# EAGLE design dma-module (EAGLE 8.4.3)
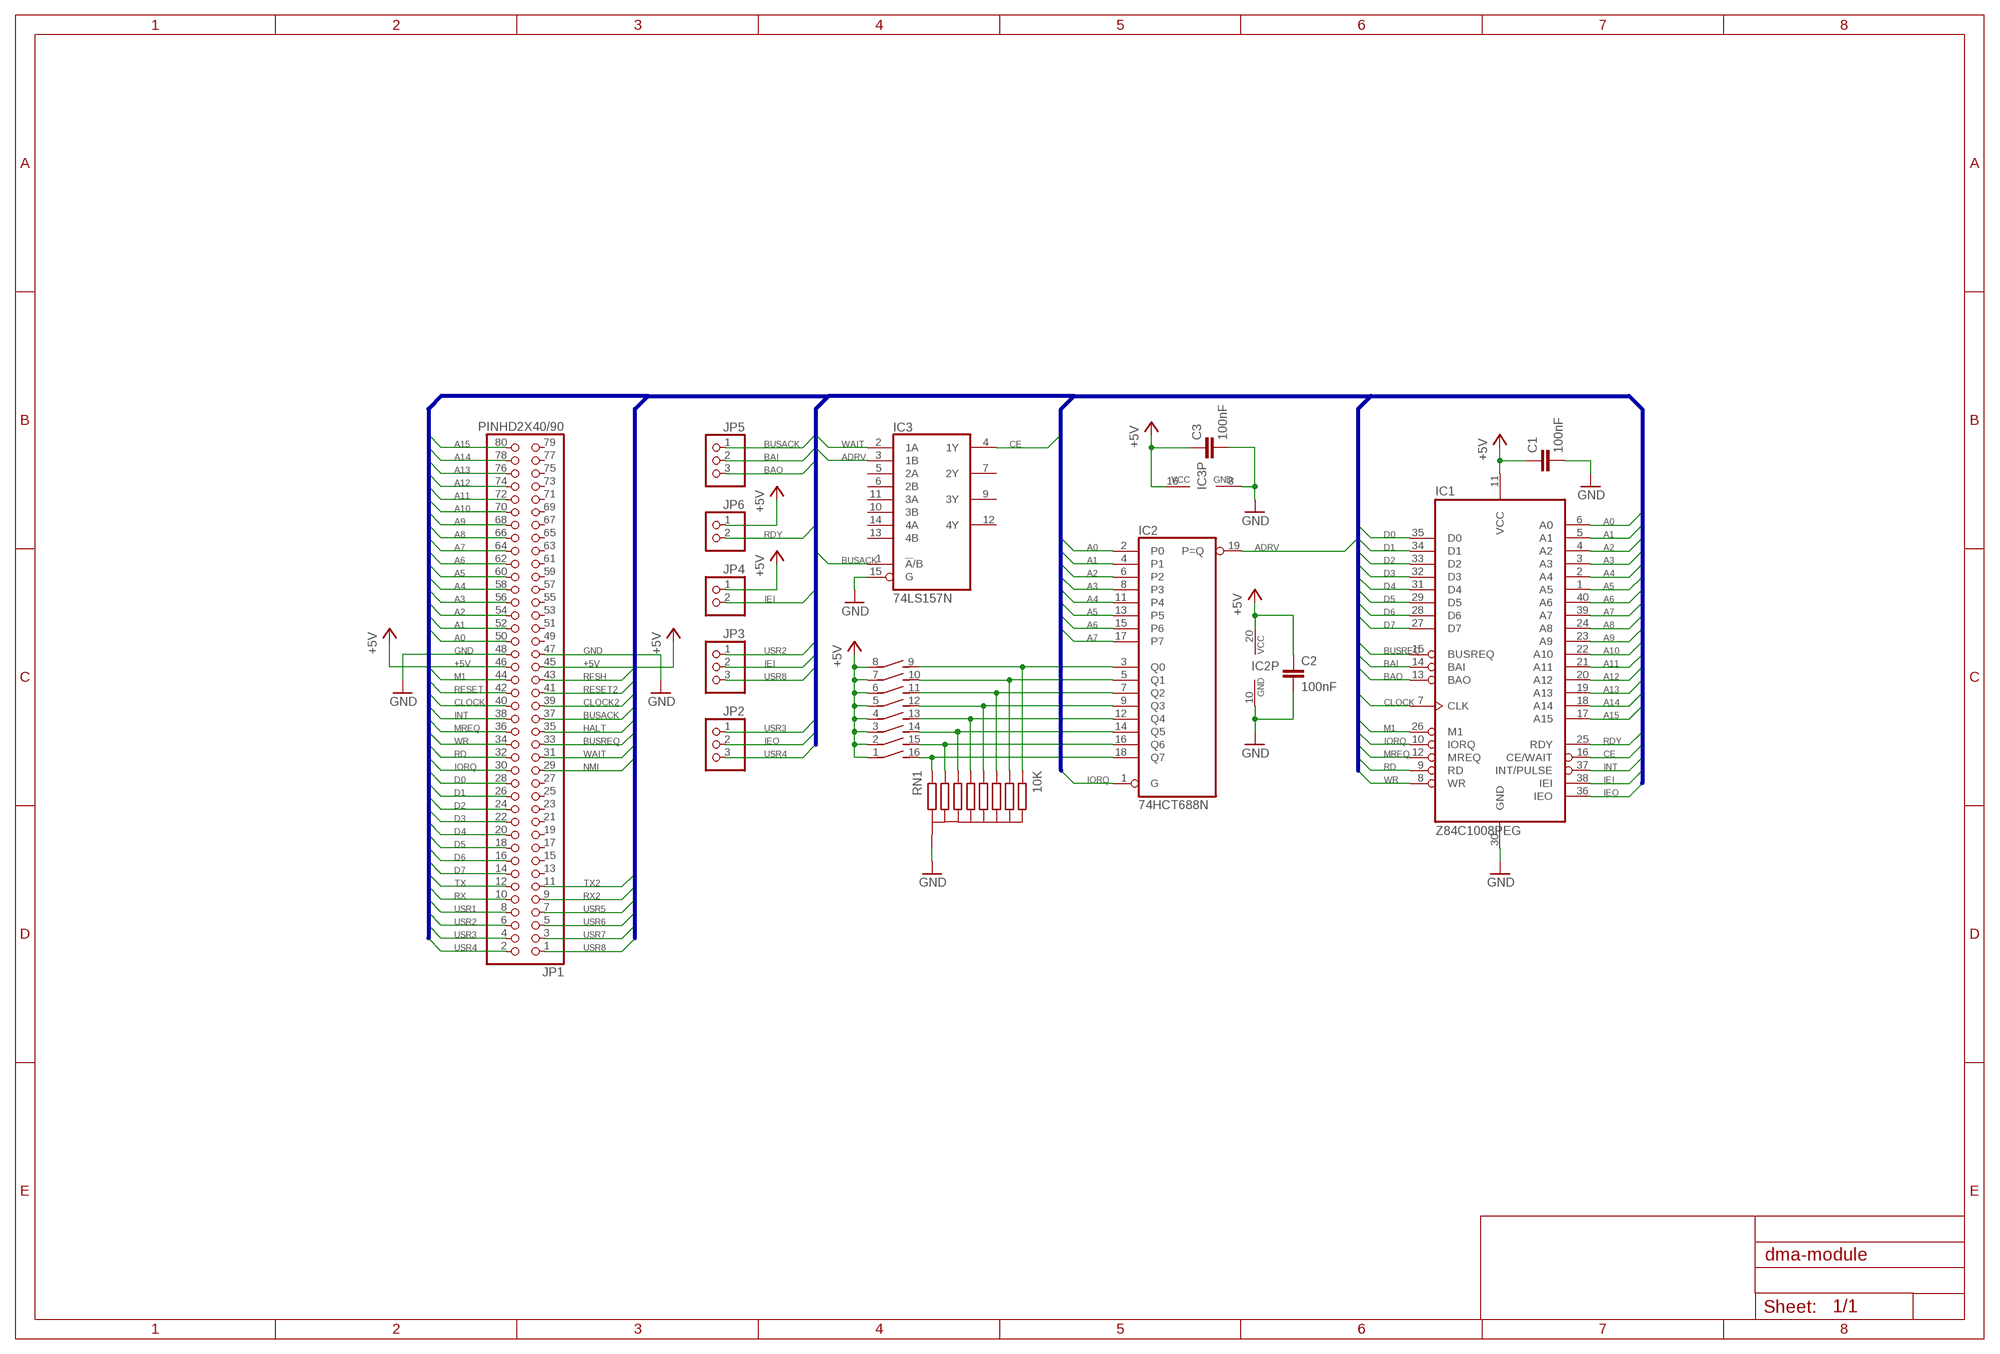
[diagram p0: schematic, sheet 1]
FRAME1 (A3L-LOC): LOGO: DMA; TITLE: Z84C10 DMA board

## Parts
C1  100nF  C-EU025-025X050  [C025-025X050]
C2  100nF  C-EU025-025X050  [C025-025X050]
C3  100nF  C-EU025-025X050  [C025-025X050]
IC1  Z84C1008PEG  [DIP40]
IC2  74HCT688N  [DIL20]
IC3  74LS157N  [DIL16]
JP1  PINHD2X40/90  [2X40/90]
JP2  PINHD-1X3/90  [1X03/90]
JP3  PINHD-1X3/90  [1X03/90]
JP4  PINHD-1X2/90  [1X02/90]
JP5  PINHD-1X3/90  [1X03/90]
JP6  PINHD-1X2/90  [1X02/90]
RN1  10K  RBUS  [RBUS]
S1  DIP08SB  [DIP08SB]

## Nets
+5V: C1.1 C2.1 C3.1 IC1.11(VCC) IC2.20(VCC) IC3.16(VCC) JP1.45 JP1.46 JP4.1 JP6.1 S1.1 S1.2 S1.3 S1.4 S1.5 S1.6 S1.7 S1.8
A0: IC1.6(A0) IC2.2(P0) JP1.50
A1: IC1.5(A1) IC2.4(P1) JP1.52
A2: IC1.4(A2) IC2.6(P2) JP1.54
A3: IC1.3(A3) IC2.8(P3) JP1.56
A4: IC1.2(A4) IC2.11(P4) JP1.58
A5: IC1.1(A5) IC2.13(P5) JP1.60
A6: IC1.40(A6) IC2.15(P6) JP1.62
A7: IC1.39(A7) IC2.17(P7) JP1.64
A8: IC1.24(A8) JP1.66
A9: IC1.23(A9) JP1.68
A10: IC1.22(A10) JP1.70
A11: IC1.21(A11) JP1.72
A12: IC1.20(A12) JP1.74
A13: IC1.19(A13) JP1.76
A14: IC1.18(A14) JP1.78
A15: IC1.17(A15) JP1.80
ADRV: IC2.19(P=Q) IC3.3(1B)
BAI: IC1.14(BAI) JP5.2
BAO: IC1.13(BAO) JP5.3
BUSACK: IC3.1(!A!/B) JP1.37 JP5.1
BUSREQ: IC1.15(BUSREQ) JP1.33
CE: IC1.16(CE/WAIT) IC3.4(1Y)
CLOCK: IC1.7(CLK) JP1.40
CLOCK2: JP1.39
D0: IC1.35(D0) JP1.28
D1: IC1.34(D1) JP1.26
D2: IC1.33(D2) JP1.24
D3: IC1.32(D3) JP1.22
D4: IC1.31(D4) JP1.20
D5: IC1.29(D5) JP1.18
D6: IC1.28(D6) JP1.16
D7: IC1.27(D7) JP1.14
GND: C1.2 C2.2 C3.2 IC1.30(GND) IC2.10(GND) IC3.8(GND) IC3.15(G) JP1.47 JP1.48 RN1.P$1(COM)
HALT: JP1.35
IEI: IC1.38(IEI) JP3.2 JP4.2
IEO: IC1.36(IEO) JP2.2
INT: IC1.37(INT/PULSE) JP1.38
IORQ: IC1.10(IORQ) IC2.1(G) JP1.30
M1: IC1.26(M1) JP1.44
MREQ: IC1.12(MREQ) JP1.36
N$9: IC2.3(Q0) RN1.P$9(R8) S1.9
N$10: IC2.5(Q1) RN1.P$8(R7) S1.10
N$11: IC2.7(Q2) RN1.P$7(R6) S1.11
N$12: IC2.9(Q3) RN1.P$6(R5) S1.12
N$13: IC2.12(Q4) RN1.P$5(R4) S1.13
N$14: IC2.14(Q5) RN1.P$4(R3) S1.14
N$15: IC2.16(Q6) RN1.P$3(R2) S1.15
N$16: IC2.18(Q7) RN1.P$2(R1) S1.16
NMI: JP1.29
RD: IC1.9(RD) JP1.32
RDY: IC1.25(RDY) JP6.2
RESET: JP1.42
RESET2: JP1.41
RFSH: JP1.43
RX: JP1.10
RX2: JP1.9
TX: JP1.12
TX2: JP1.11
USR1: JP1.8
USR2: JP1.6 JP3.1
USR3: JP1.4 JP2.1
USR4: JP1.2 JP2.3
USR5: JP1.7
USR6: JP1.5
USR7: JP1.3
USR8: JP1.1 JP3.3
WAIT: IC3.2(1A) JP1.31
WR: IC1.8(WR) JP1.34
Unconnected: IC3.5(2A) IC3.6(2B) IC3.7(2Y) IC3.9(3Y) IC3.10(3B) IC3.11(3A) IC3.12(4Y) IC3.13(4B) IC3.14(4A) JP1.13 JP1.15 JP1.17 JP1.19 JP1.21 JP1.23 JP1.25 JP1.27 JP1.49 JP1.51 JP1.53 JP1.55 JP1.57 JP1.59 JP1.61 JP1.63 JP1.65 JP1.67 JP1.69 JP1.71 JP1.73 JP1.75 JP1.77 JP1.79

## Buses
A0,A1,A2,A3,A4,A5,A6,A7,A8,A9,A10,A11,A12,A13,A14,A15,M1,RESET,CLOCK,INT,MREQ,WR,RD,IORQ,D0,D1,D2,D3,D4,D5,D6,D7,TX,RX,USR1,USR2,USR3,USR4,RFSH,RESET2,CLOCK2,BUSACK,HALT,BUSREQ,WAIT,NMI,TX2,RX2,USR5,USR6,USR7,USR8,IEI,IEO,BAI,BAO,CE,ADRV,RDY

## Library data of the parts
C1-C3 = rcl:C-EU: CAPACITOR, European symbol
IC1 = z80dma:Z84C1008PEG
IC2 = 74xx-eu:74*688: 8-bit MAGNITUDE/IDENTITY COMPARATOR, totem pole
IC3 = 74xx-eu:74*157: Quadruple 2-line to 1-line data SELECTOR/MULTIPLEXER
JP1 = pinhead:PINHD2X40/90
JP2 JP3 JP5 = pinhead:PINHD-1X3: PIN HEADER
JP4 JP6 = pinhead:PINHD-1X2: PIN HEADER
RN1 = rbus:RBUS
S1 = switch-dil:DIP08SB: DIL/CODE SWITCH; OC_FARNELL: unknown; OC_NEWARK: unknown

## Board
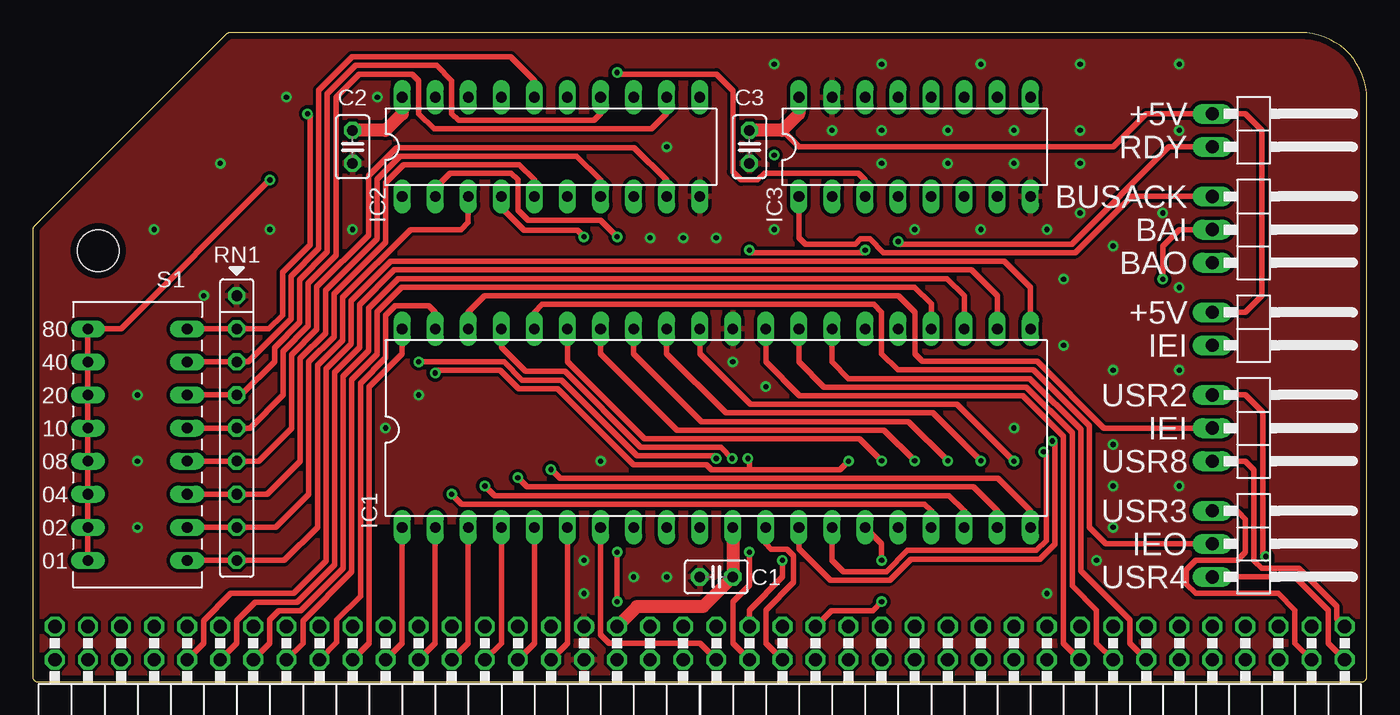
[diagram p1: board, top side]
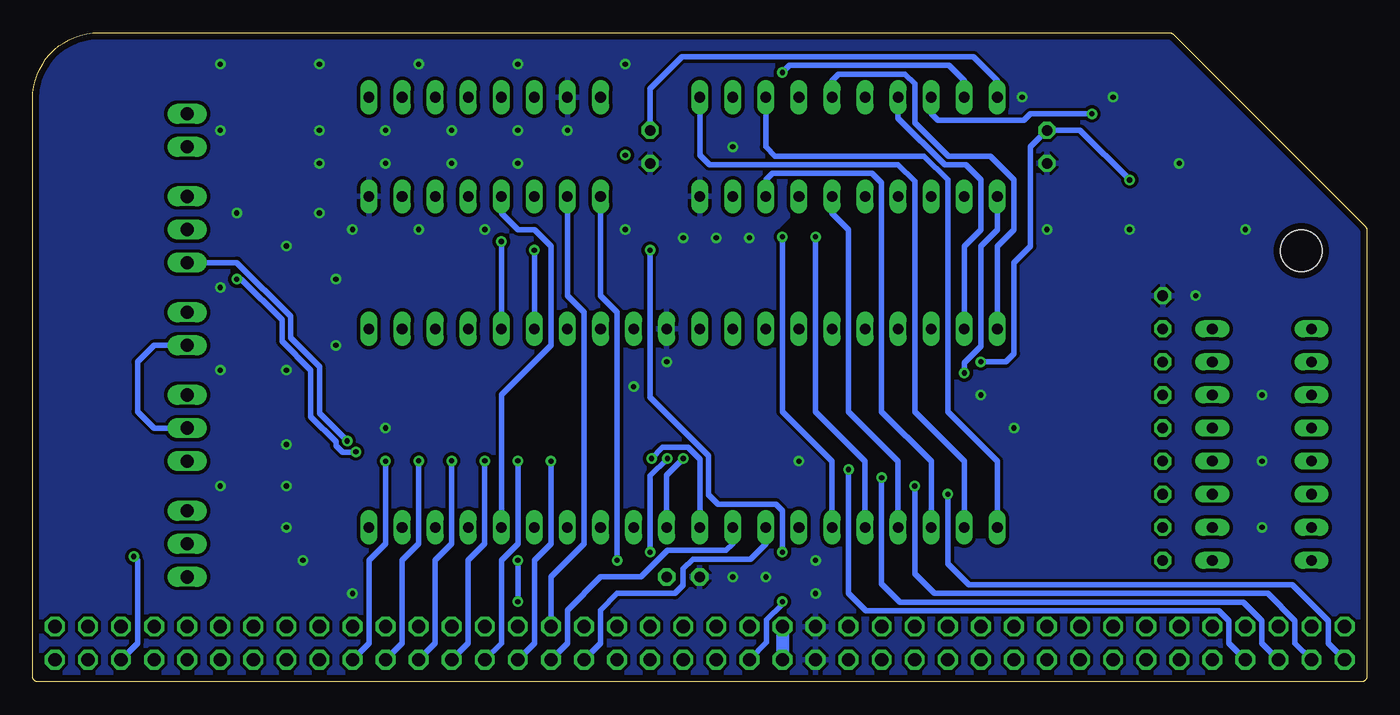
[diagram p2: board, bottom side, seen from below]

Size 102.49 x 49.86 mm. Coordinates in mm from the lower left corner, seen from the top.
Outline: 0,34.66 0,0.45 arc90 0.45,0 102.05,0 arc90 102.49,0.45 102.49,44.76 arc90 97.39,49.86 15.2,49.86 arc45 14.88,49.73 0.13,34.98 arc45 0,34.66
Copper layers (1*16): Top 0.035mm / dielectric 1.5mm / Bottom 0.035mm
Design rules "default *": minimum track width 16mil, minimum drill 0.4mm, track to track 10mil, track to pad 10mil, pad to pad 10mil, via to via 10mil, smd to smd 10mil, copper to edge 20mil, drill to drill 6mil, minimum pad ring 10mil, minimum via ring 8mil, stop-mask expansion 4mil, vias tented up to drill 0.41mm, thermal gap 10mil
Holes 3.2 mm at 5.03,33.12

### Footprints (pad centres in the part's own frame; a part is rotated, then mirrored left to right if it is on the bottom)
C025-025X050 = drill 0.813 octagon: 1 -1.27,0; 2 1.27,0
DIP40 = drill 0.813 long: 1 -24.13,-7.62; 2 -21.59,-7.62; 3 -19.05,-7.62; 4 -16.51,-7.62; 5 -13.97,-7.62; 6 -11.43,-7.62; 7 -8.89,-7.62; 8 -6.35,-7.62; 9 -3.81,-7.62; 10 -1.27,-7.62; 11 1.27,-7.62; 12 3.81,-7.62; 13 6.35,-7.62; 14 8.89,-7.62; 15 11.43,-7.62; 16 13.97,-7.62; 17 16.51,-7.62; 18 19.05,-7.62; 19 21.59,-7.62; 20 24.13,-7.62; 21 24.13,7.62; 22 21.59,7.62; 23 19.05,7.62; 24 16.51,7.62; 25 13.97,7.62; 26 11.43,7.62; 27 8.89,7.62; 28 6.35,7.62; 29 3.81,7.62; 30 1.27,7.62; 31 -1.27,7.62; 32 -3.81,7.62; 33 -6.35,7.62; 34 -8.89,7.62; 35 -11.43,7.62; 36 -13.97,7.62; 37 -16.51,7.62; 38 -19.05,7.62; 39 -21.59,7.62; 40 -24.13,7.62
DIL20 = drill 0.813 long: 1 -11.43,-3.81; 2 -8.89,-3.81; 3 -6.35,-3.81; 4 -3.81,-3.81; 5 -1.27,-3.81; 6 1.27,-3.81; 7 3.81,-3.81; 8 6.35,-3.81; 9 8.89,-3.81; 10 11.43,-3.81; 11 11.43,3.81; 12 8.89,3.81; 13 6.35,3.81; 14 3.81,3.81; 15 1.27,3.81; 16 -1.27,3.81; 17 -3.81,3.81; 18 -6.35,3.81; 19 -8.89,3.81; 20 -11.43,3.81
DIL16 = drill 0.813 long: 1 -8.89,-3.81; 2 -6.35,-3.81; 3 -3.81,-3.81; 4 -1.27,-3.81; 5 1.27,-3.81; 6 3.81,-3.81; 7 6.35,-3.81; 8 8.89,-3.81; 9 8.89,3.81; 10 6.35,3.81; 11 3.81,3.81; 12 1.27,3.81; 13 -1.27,3.81; 14 -3.81,3.81; 15 -6.35,3.81; 16 -8.89,3.81
2X40/90 = drill 1.016 octagon: 1 -49.53,-1.27; 2 -49.53,1.27; 3 -46.99,-1.27; 4 -46.99,1.27; 5 -44.45,-1.27; 6 -44.45,1.27; 7 -41.91,-1.27; 8 -41.91,1.27; 9 -39.37,-1.27; 10 -39.37,1.27; 11 -36.83,-1.27; 12 -36.83,1.27; 13 -34.29,-1.27; 14 -34.29,1.27; 15 -31.75,-1.27; 16 -31.75,1.27; 17 -29.21,-1.27; 18 -29.21,1.27; 19 -26.67,-1.27; 20 -26.67,1.27; 21 -24.13,-1.27; 22 -24.13,1.27; 23 -21.59,-1.27; 24 -21.59,1.27; 25 -19.05,-1.27; 26 -19.05,1.27; 27 -16.51,-1.27; 28 -16.51,1.27; 29 -13.97,-1.27; 30 -13.97,1.27; 31 -11.43,-1.27; 32 -11.43,1.27; 33 -8.89,-1.27; 34 -8.89,1.27; 35 -6.35,-1.27; 36 -6.35,1.27; 37 -3.81,-1.27; 38 -3.81,1.27; 39 -1.27,-1.27; 40 -1.27,1.27; 41 1.27,-1.27; 42 1.27,1.27; 43 3.81,-1.27; 44 3.81,1.27; 45 6.35,-1.27; 46 6.35,1.27; 47 8.89,-1.27; 48 8.89,1.27; 49 11.43,-1.27; 50 11.43,1.27; 51 13.97,-1.27; 52 13.97,1.27; 53 16.51,-1.27; 54 16.51,1.27; 55 19.05,-1.27; 56 19.05,1.27; 57 21.59,-1.27; 58 21.59,1.27; 59 24.13,-1.27; 60 24.13,1.27; 61 26.67,-1.27; 62 26.67,1.27; 63 29.21,-1.27; 64 29.21,1.27; 65 31.75,-1.27; 66 31.75,1.27; 67 34.29,-1.27; 68 34.29,1.27; 69 36.83,-1.27; 70 36.83,1.27; 71 39.37,-1.27; 72 39.37,1.27; 73 41.91,-1.27; 74 41.91,1.27; 75 44.45,-1.27; 76 44.45,1.27; 77 46.99,-1.27; 78 46.99,1.27; 79 49.53,-1.27; 80 49.53,1.27
1X03/90 = drill 1.016 long: 1 -2.54,-3.81; 2 0,-3.81; 3 2.54,-3.81
1X02/90 = drill 1.016 long: 1 -1.27,-3.81; 2 1.27,-3.81
RBUS = drill 0.813 octagon: P$1 0,0; P$2 2.54,0; P$3 5.08,0; P$4 7.62,0; P$5 10.16,0; P$6 12.7,0; P$7 15.24,0; P$8 17.78,0; P$9 20.32,0
DIP08SB = drill 0.813 long: 1 -8.89,-3.81; 2 -6.35,-3.81; 3 -3.81,-3.81; 4 -1.27,-3.81; 5 1.27,-3.81; 6 3.81,-3.81; 7 6.35,-3.81; 8 8.89,-3.81; 9 8.89,3.81; 10 6.35,3.81; 11 3.81,3.81; 12 1.27,3.81; 13 -1.27,3.81; 14 -3.81,3.81; 15 -6.35,3.81; 16 -8.89,3.81

### Placement (x,y rotation side)
C1  52.52,8.06 180 top
C2  24.57,41.09 270 top
C3  55.05,41.09 270 top
IC1  52.52,19.5 0 top
IC2  39.81,41.09 0 top
IC3  67.75,41.09 0 top
JP1  51.24,2.98 180 top
JP2  94.42,10.61 270 top
JP3  94.42,19.5 270 top
JP4  94.42,27.11 270 top
JP5  94.42,34.73 270 top
JP6  94.42,42.35 270 top
RN1  15.69,29.66 270 top
S1  8.06,18.23 270 top

### Tracks (layer width: path | path; a pad name or v marks a point on that pad's centre or on a via)
+5V  (via drill 0.4)
  Top 0.406: v29.66,24.57 36.2,24.57 37.59,23.18 40.61,23.18 46.44,17.36 52.31,17.36 v52.52,17.16 | 57.59,42.35 58.87,41.09 83,41.09 85.53,43.62 JP6.1 93.16,43.62 94.42,42.35 94.42,29.66 93.16,28.39 JP4.1 | S1.8 S1.7 S1.6 S1.5 S1.4 S1.3 S1.2 S1.1 6.79,27.11 v18.23,38.55
  Top 1.016: IC2.20 28.39,43.62 27.11,42.35 C2.1 | IC3.16 58.87,43.62 57.59,42.35 C3.1 | IC1.11 C1.1 51.5,5.78 46.42,5.78 JP1.45
  Bottom 0.406: v29.66,24.57 27.75,24.57 27.11,25.21 27.11,32.2 25.84,33.47 25.84,41.09 C2.1 22.04,42.35 v18.23,38.55 | IC2.20 28.39,46.16 30.21,47.99 52.59,47.99 55.05,45.53 C3.1 | v52.52,17.16 53.78,15.88 IC1.11
  Bottom 1.016: JP1.45 JP1.46
A0  (via drill 0.4)
  Top 0.406: IC1.6 41.09,2.98 JP1.50 | IC2.2 30.93,37.91 32.07,39.05 36.77,39.05 37.27,38.55 37.27,36.23 38.06,35.45 43.62,35.45 v44.9,34.17
  Bottom 0.406: IC1.6 41.09,16.95 44.9,20.77 v44.9,34.17
A1  (via drill 0.4)
  Top 0.406: IC1.5 38.55,2.98 JP1.52 | v42.35,34.17 41.84,34.68 37.74,34.68 36.01,36.42 IC2.4
  Bottom 0.406: IC1.5 38.55,16.95 42.35,20.77 v42.35,34.17
A2
  Top 0.406: IC1.4 36.01,2.98 JP1.54
  Bottom 0.406: IC1.4 36.01,16.95 39.81,20.77 39.81,34.73 41.09,36.01 IC2.6
A3
  Top 0.406: IC1.3 33.47,2.98 JP1.56
  Bottom 0.406: IC1.3 33.47,16.95 37.27,20.77 37.27,38.32 38.01,39.05 45.66,39.05 46.16,38.55 IC2.8
A4
  Top 0.406: IC1.2 30.93,2.98 JP1.58
  Bottom 0.406: IC1.2 30.93,16.95 34.73,20.77 34.73,38.44 36.01,39.71 50.51,39.71 51.24,40.45 IC2.11
A5
  Top 0.406: IC1.1 28.39,2.98 JP1.60
  Bottom 0.406: IC1.1 28.39,16.95 32.2,20.77 32.2,38.55 34.02,40.37 45.45,40.37 46.16,41.09 IC2.13
A6
  Top 0.406: JP1.62 25.84,2.98 25.84,22.67 28.39,25.21 IC1.40
  Bottom 0.406: IC1.40 28.39,33.47 27.11,34.73 27.11,38.55 28.93,40.36 32.14,40.36 34.73,42.95 34.73,45.94 35.47,46.67 40.58,46.67 41.09,46.16 IC2.15
A7
  Top 0.406: JP1.64 23.36,3.04 23.36,4.76 25.18,6.59 25.18,22.94 27.11,24.87 27.11,28.16 27.85,28.89 30.42,28.89 30.93,28.39 IC1.39
  Bottom 0.406: IC1.39 30.93,33.47 29.66,34.73 29.66,38.55 30.81,39.7 32.42,39.7 36.01,43.29 IC2.17
A8
  Top 0.406: JP1.66 20.77,2.98 20.77,4.71 24.52,8.47 24.52,23.22 26.45,25.15 26.45,28.43 28.34,30.31 67.73,30.31 69.03,29.02 IC1.24
A9
  Top 0.406: JP1.68 18.23,2.98 18.23,4.78 18.92,5.47 20.6,5.47 23.86,8.74 23.86,23.49 25.79,25.42 25.79,28.7 28.06,30.97 70.25,30.97 71.56,29.66 IC1.23
A10
  Top 0.406: JP1.70 15.69,2.98 15.69,4.71 17.11,6.13 20.32,6.13 23.2,9.02 23.2,23.76 25.13,25.7 25.13,28.98 27.79,31.63 72.13,31.63 74.11,29.66 IC1.22
A11
  Top 0.406: IC1.21 76.64,30.29 74.64,32.29 27.52,32.29 24.47,29.25 24.47,25.97 22.54,24.04 22.54,9.29 20.05,6.79 15.23,6.79 13.14,4.71 13.14,2.98 JP1.72
A12  (via drill 0.4)
  Top 0.406: IC1.20 76.64,13.14 74.16,15.63 40.5,15.63 v39.81,16.32
  Bottom 0.406: JP1.74 10.61,2.98 10.61,4.71 11.37,5.47 38.49,5.47 39.81,6.79 v39.81,16.32
A13  (via drill 0.4)
  Top 0.406: IC1.19 74.11,13.14 72.28,14.97 37.99,14.97 v37.27,15.69
  Bottom 0.406: JP1.76 8.06,2.98 8.06,4.71 9.49,6.13 35.85,6.13 37.27,7.56 v37.27,15.69
A14  (via drill 0.4)
  Top 0.406: IC1.18 71.56,13.14 70.4,14.31 35.47,14.31 v34.73,15.05
  Bottom 0.406: JP1.78 5.53,2.98 5.53,4.71 7.61,6.79 33.21,6.79 34.73,8.32 v34.73,15.05
A15  (via drill 0.4)
  Top 0.406: IC1.17 69.03,13.14 68.52,13.65 32.96,13.65 v32.2,14.41
  Bottom 0.406: v32.2,14.41 32.2,9.08 30.57,7.46 5.73,7.46 2.98,4.71 2.98,2.98 JP1.80
ADRV  (via drill 0.4)
  Top 0.406: v44.9,46.8 45.02,46.67 52.52,46.67 53.78,45.4 53.78,39.18 54.42,38.55 55.69,38.55 56.2,39.05 63.44,39.05 63.95,38.55 IC3.3
  Bottom 0.406: IC2.19 30.93,46.16 32.09,47.33 44.36,47.33 v44.9,46.8
BAI  (via drill 0.4)
  Top 0.406: IC1.14 61.41,9.34 62.27,8.47 65.57,8.47 67.19,10.1 77.11,10.1 77.86,10.85 77.86,17.46 v77.66,17.66 | v86.81,30.93 86.81,33.47 88.08,34.73 JP5.2
  Bottom 0.406: v77.66,17.66 77.69,17.64 78.68,17.64 79.19,18.15 79.19,18.43 81.11,20.36 81.11,23.94 83.34,26.16 83.34,27.79 86.47,30.93 v86.81,30.93
BAO  (via drill 0.4)
  Top 0.406: IC1.13 58.87,10.22 61.27,7.81 65.84,7.81 67.47,9.44 77.38,9.44 78.53,10.58 78.53,18.3 v78.33,18.5
  Bottom 0.406: v78.33,18.5 80.45,20.63 80.45,24.21 82.68,26.44 82.68,28.07 86.81,32.2 JP5.3
BUSACK  (via drill 0.4)
  Top 0.406: JP1.37 55.05,5.53 57.59,8.06 v57.59,9.34 | IC3.1 58.87,34.1 59.35,33.62 63.19,33.62 63.59,34.02 64.3,34.02 65.36,32.95 80.09,32.95 84.41,37.27 JP5.1
  Bottom 0.406: IC3.1 58.87,29.66 57.59,28.39 v57.59,9.34
BUSREQ  (via drill 0.4)
  Top 0.406: IC1.15 65.22,10.61 v65.22,9.34 | v65.22,6.16 64.53,5.47 61.35,5.47 JP1.33
  Bottom 0.406: v65.22,9.34 v65.22,6.16
CE
  Bottom 0.406: IC1.16 66.48,22.04 62.67,25.84 62.67,33.47 63.95,34.73 65.22,34.73 66.48,36.01 IC3.4
CLOCK
  Top 0.406: JP1.40 51.24,2.98 44.26,2.98 43.62,3.62 IC1.7
D0  (via drill 0.4)
  Top 0.406: IC1.35 41.09,24.57 46.98,18.68 63.52,18.68 v65.22,16.98
  Bottom 0.406: JP1.28 66.48,2.98 66.48,9.34 65.22,10.61 v65.22,16.98
D1  (via drill 0.4)
  Top 0.406: IC1.34 43.62,25.21 49.5,19.34 65.4,19.34 v67.75,16.98
  Bottom 0.406: JP1.26 69.03,2.98 69.03,9.34 67.75,10.61 v67.75,16.98
D2  (via drill 0.4)
  Top 0.406: IC1.33 46.16,25.21 51.38,20 67.28,20 v70.3,16.98
  Bottom 0.406: JP1.24 71.56,2.98 71.56,9.34 70.3,10.61 v70.3,16.98
D3  (via drill 0.4)
  Top 0.406: IC1.32 48.7,25.21 53.26,20.66 69.16,20.66 v72.83,16.98
  Bottom 0.406: JP1.22 74.11,2.98 74.11,9.34 72.83,10.61 v72.83,16.98
D4  (via drill 0.4)
  Top 0.406: IC1.31 51.24,25.21 55.14,21.32 71.01,21.32 v75.38,16.95
  Bottom 0.406: JP1.20 76.64,2.98 76.64,9.34 75.38,10.61 v75.38,16.95
D5
  Top 0.406: IC1.29 56.33,24.57 58.92,21.98 76.07,21.98 79.19,18.86 79.19,2.98 JP1.18
D6
  Top 0.406: IC1.28 58.87,24.57 60.8,22.64 76.34,22.64 79.84,19.13 79.84,7.41 81.72,5.53 81.72,2.98 JP1.16
D7
  Top 0.406: IC1.27 61.41,24.57 62.68,23.3 76.61,23.3 80.51,19.41 80.51,8.54 84.27,4.78 84.27,2.98 JP1.14
GND  (via drill 0.4)
  other vias: 77.92,6.79 81.72,9.34 83,11.88 83,15.05 83,18.23 83,23.94 75.38,19.5 29.66,22.04 27.11,19.5 43.62,16.95 42.35,9.34 42.35,6.79 46.16,8.06 48.7,8.06 26.48,44.9 24.57,34.73 18.23,34.73 19.5,44.9 56.96,34.73 52.52,34.1 49.98,34.1 47.44,34.1 61.41,42.35 67.75,34.73 72.83,34.73 77.92,34.73 79.19,30.93 79.19,25.84 83,33.47 80.45,36.01 80.45,39.81 80.45,42.35 75.38,42.35 75.38,39.81 70.3,39.81 70.3,42.35 65.22,42.35 65.22,39.81 65.22,47.44 72.83,47.44 80.45,47.44 56.96,47.44 53.78,24.57 56.33,22.67 9.34,34.73 13.14,29.66 14.41,39.81 8.06,22.04 8.06,16.95 8.06,11.88 88.08,15.05 88.08,23.94 88.08,30.29 86.81,36.01 88.08,42.35 88.08,47.44 48.7,41.09
  pour Bottom: 0,0 0,50.8 104.14,50.8 104.14,0
  pour Top: 0,0 0,50.8 104.14,50.8 104.14,0
  cutout Bottom: 28.39,11.88 33.47,11.88 33.47,11.24 28.39,11.24
  cutout Top: 26.48,11.88 33.47,11.88 33.47,11.24 26.48,11.24
  cutout Bottom: 43.62,36.01 44.9,34.73 44.9,34.1 44.26,34.1 42.99,35.37 42.99,36.01
IEI
  Top 0.406: IC1.38 33.47,28.39 34.73,29.65 66.49,29.65 67.75,28.39 67.75,25.21 68.35,24.62 77.16,24.62 82.29,19.5 JP3.2
  Bottom 0.406: JP3.2 93.16,19.5 94.42,20.77 94.42,24.57 93.16,25.84 JP4.2
IEO
  Top 0.406: IC1.36 38.55,28.39 39.15,28.99 64.61,28.99 65.22,28.39 65.22,25.21 66.47,23.96 76.89,23.96 81.17,19.68 81.17,11.88 82.44,10.61 JP2.2
INT  (via drill 0.4)
  Top 0.406: IC1.37 36.01,25.7 37.87,23.84 40.89,23.84 46.71,18.02 52.87,18.02 v53.73,17.16 | JP1.38 53.78,2.98 53.78,6.16 55.05,7.43 v55.05,9.97
  Bottom 0.406: v53.73,17.16 55.05,15.83 v55.05,9.97
IORQ  (via drill 0.4)
  Top 0.406: v30.93,23.71 30.93,23.91 35.92,23.91 37.32,22.52 40.34,22.52 46.16,16.7 51.76,16.7 52.16,16.3 55.05,16.3 | v62.67,16.95 62.02,16.3 55.05,16.3 | v54.95,17.16 55.05,17.05 55.05,16.3
  Bottom 0.406: IC2.1 28.39,34.73 29.66,33.47 29.66,25.79 30.93,24.52 v30.93,23.71 | JP1.30 63.95,2.98 63.95,9.34 62.67,10.61 v62.67,16.95 | v54.95,17.16 54.09,18.02 52.16,18.02 51.24,17.1 IC1.10
M1  (via drill 0.4)
  Top 0.406: v44.9,6.16 v44.9,9.97 | v55.05,33.15 55.26,32.95 63.74,32.95 v63.95,33.15
  Bottom 0.406: v44.9,6.16 44.9,5.98 46.11,4.76 46.11,3.04 JP1.44 | v44.9,9.97 44.9,13.14 45.4,13.65 49.85,13.65 50.59,14.39 50.59,17.38 55.05,21.85 v55.05,33.15 | v63.95,33.15 IC1.26
MREQ
  Top 0.406: IC1.12 56.33,10.61 56.73,10.2 57.95,10.2 58.45,9.69 58.45,7.66 56.33,5.53 56.33,2.98 JP1.36
N$4  (via drill 0.4)
  other vias: 56.96,40.45
N$9
  Top 0.406: IC2.3 33.47,35.29 32.91,34.73 29.02,34.73 23.81,29.53 23.81,26.24 21.88,24.31 21.88,11.88 19.34,9.34 RN1.P$9 S1.9
N$10
  Top 0.406: S1.10 RN1.P$8 18.68,11.88 21.22,14.41 21.22,24.59 23.15,26.52 23.15,29.8 27.11,33.76 27.11,38.32 28.51,39.71 37.38,39.71 38.55,38.55 IC2.5
N$11
  Top 0.406: IC2.7 43.62,38.55 41.8,40.37 28.24,40.37 26.45,38.59 26.45,34.03 22.49,30.07 22.49,26.79 20.56,24.86 20.56,16.95 18.02,14.41 RN1.P$7 S1.11
N$12
  Top 0.406: IC2.9 48.7,38.55 46.22,41.03 27.96,41.03 25.79,38.87 25.79,34.31 21.83,30.35 21.83,27.06 19.9,25.13 19.9,19.5 17.36,16.95 RN1.P$6 S1.12
N$13
  Top 0.406: IC2.12 48.7,43.62 47.54,42.46 30.82,42.46 29.66,43.62 29.66,46.16 29.15,46.67 25.08,46.67 23.3,44.9 23.3,32.75 21.17,30.62 21.17,27.34 19.24,25.41 19.24,22.04 16.7,19.5 RN1.P$5 S1.13
N$14
  Top 0.406: IC2.14 43.62,43.62 43.12,43.12 32.7,43.12 32.2,43.62 32.2,46.16 31.03,47.33 24.81,47.33 22.64,45.17 22.64,33.03 20.51,30.89 20.51,27.61 18.58,25.68 18.58,24.57 16.04,22.04 RN1.P$4 S1.14
N$15
  Top 0.406: IC2.16 38.55,46.16 36.72,47.99 24.54,47.99 21.98,45.44 21.98,33.3 19.85,31.17 19.85,27.88 16.54,24.57 RN1.P$3 S1.15
N$16  (via drill 0.4)
  Top 0.406: S1.16 RN1.P$2 18.15,27.11 19.19,28.16 19.19,31.44 21.32,33.57 21.32,43.42 v21.12,43.62
  Bottom 0.406: IC2.18 33.47,43.62 32.96,43.12 26.35,43.12 25.84,43.62 v21.12,43.62
RD
  Bottom 0.406: IC1.9 48.7,10.61 49.21,10.1 53.71,10.1 55.74,8.06 58.87,8.06 61.41,5.53 61.41,2.98 JP1.32
RDY  (via drill 0.4)
  Top 0.406: v66.48,33.81 66.69,33.62 79.82,33.62 87.29,41.09 JP6.2
  Bottom 0.406: IC1.25 v66.48,33.81
USR2  (via drill 0.4)
  Top 0.406: JP3.1 93.16,22.04 94.48,20.71 94.48,9.87 v94.72,9.63
  Bottom 0.406: v94.72,9.63 94.42,9.34 94.42,2.98 JP1.6
USR3
  Top 0.406: JP2.1 92.52,13.14 93.16,12.51 93.16,9.97 92.52,9.34 89.34,9.34 88.63,8.62 88.63,7.51 89.34,6.79 95.69,6.79 96.97,5.53 96.97,2.98 JP1.4
USR4
  Top 0.406: JP2.3 96.97,8.06 99.5,5.53 99.5,2.98 JP1.2
USR8
  Top 0.406: JP3.3 93.16,16.95 93.81,16.3 93.81,9.31 94.4,8.72 97.24,8.72 100.17,5.8 100.17,4.87 JP1.1
WAIT
  Bottom 0.406: IC3.2 61.41,29.66 60.13,28.39 60.13,10.61 62.67,8.06 JP1.31
WR
  Bottom 0.406: IC1.8 46.16,10.61 47.33,9.44 51.78,9.44 52.52,8.7 52.52,7.43 53.15,6.79 57.59,6.79 58.87,5.53 58.87,2.98 JP1.34

### Text on the board
tPlace: +5V | RDY | BUSACK | BAI | BAO | +5V | 80 | IEI | 40 | 20 | USR2 | 10 | IEI | 08 | USR8 | 04 | USR3 | 02 | IEO | 01 | USR4